# EAGLE schematic SparkWireInterface (EAGLE 9.7.0)
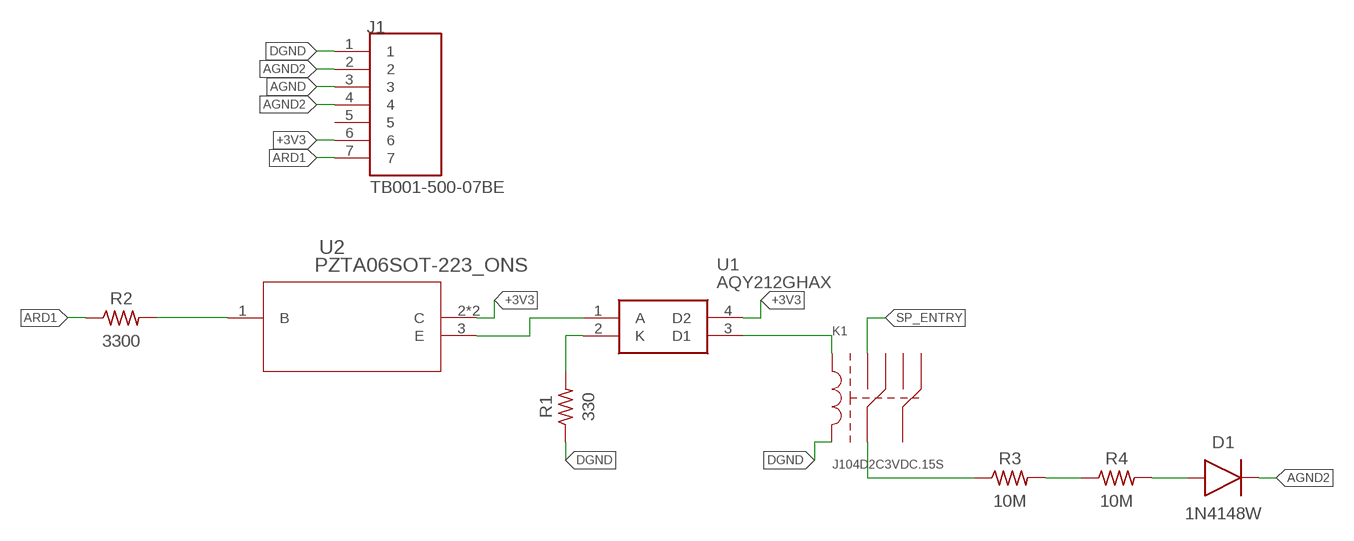
[diagram p0: schematic, sheet 1]

## Parts
D1  1N4148W  DIODE_1N4148W-7-F_SOD123G  [SOD3715X135]
J1  TB001-500-07BE  [CUI_TB001-500-07BE]
K1  J104D2C3VDC.15S  [J104D2C3VDC.15S]
R1  330  R-US_CHIP-0603(1608-METRIC)  [RESC1608X60]
R2  3300  R-US_CHIP-0603(1608-METRIC)  [RESC1608X60]
R3  10M  R-US_CHIP-2512(6332-METRIC)  [RESC6332X71]
R4  10M  R-US_CHIP-2512(6332-METRIC)  [RESC6332X71]
U1  AQY212GHAX  [SOP254P962X315-4N]
U2  PZTA06SOT-223_ONS  [SOT-223_ONS]

## Nets
+3V3: J1.6 U1.4(D2) U2.2(C) U2.4(C)
AGND: J1.3
AGND2: D1.1(C) J1.2 J1.4
ARD1: J1.7 R2.1
DGND: J1.1 K1.1(LA) R1.1
N$1: K1.2(LB) U1.3(D1)
N$6: U1.1(A) U2.3(E)
N$7: R1.2 U1.2(K)
N$8: R2.2 U2.1(B)
N$9: K1.3(C1) R3.1
N$10: R3.2 R4.1
N$11: D1.2(A) R4.2
SP_ENTRY: K1.7(NO1)
Unconnected: J1.5 K1.4(C2) K1.5(NC1) K1.6(NC2) K1.8(NO2)

## Library data of the parts
D1 = Diode:DIODE_: Diode Rectifier - Popular parts; CATEGORY: Diode; DESCRIPTION: DIODE GEN PURP 100V 300MA SOD123; MANUFACTURER: Diodes Incorporated; SUB-CATEGORY: Rectifier
J1 = ADVANCEDPBTLIB:TB001-500-07BE; MANUFACTURER: CUI; STANDARD: Manufacturer Recommendations
K1 = ADVANCEDPBTLIB:J104D2C3VDC.15S
R1-R4 = Resistor:R-US: Resistor Fixed - ANSI; CATEGORY: Resistor; SUB-CATEGORY: Fixed
U1 = ADVANCEDPBTLIB:AQY212GHAX: PANASONIC - AQY212GHAX - MOSFET Relay, SPST-NO, 1.1 A, Gull Wing, 60 V, 0.7 ohm, 5 kV Source: Datasheet <https://www.digikey.in/product-detail/en/panasonic-electric-works/AQY212GHAX/255-6063-1-ND/8549338>; ARROW_PART_NUMBER: AQY212GHAX; ARROW_PRICE-STOCK: https://www.arrow.com/en/products/aqy212ghax/panasonic?region=europe; DESCRIPTION: PANASONIC - AQY212GHAX - MOSFET Relay, SPST-NO, 1.1 A, Gull Wing, 60 V, 0.7 ohm, 5 kV; HEIGHT: 3.15mm; MANUFACTURER_NAME: Panasonic; MANUFACTURER_PART_NUMBER: AQY212GHAX; MOUSER_PART_NUMBER: 667-AQY212GHAX; MOUSER_PRICE-STOCK: https://www.mouser.co.uk/ProductDetail/Panasonic-Industrial-Devices/AQY212GHAX?qs=wKtUvITRiamLwz7hthc4Hg%3D%3D
U2 = ADVANCEDPBTLIB:PZTA06; COPYRIGHT: Copyright (C) 2022 Ultra Librarian. All rights reserved.; DIGI-KEY_PART_NUMBER_1: PZTA06TR-ND; DIGI-KEY_PART_NUMBER_2: PZTA06CT-ND; DIGI-KEY_PART_NUMBER_3: PZTA06DKR-ND; MANUFACTURER_PART_NUMBER: PZTA06; MFR_NAME: onsemi